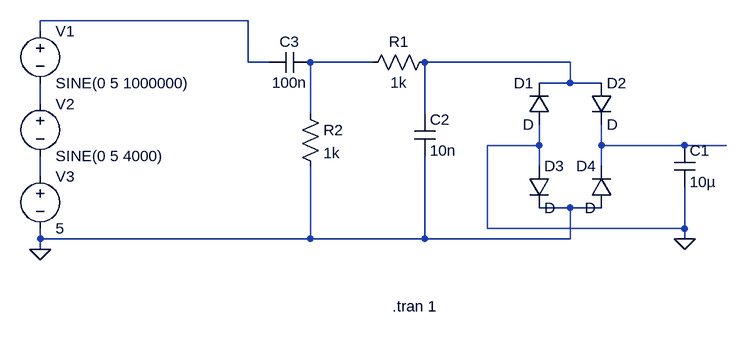
[diagram p0: schematic demodulator_spice_model.asc]
demodulator_spice_model.asc, the LTspice schematic file:
Version 4
SHEET 1 880 680
WIRE -416 -128 -736 -128
WIRE -736 -112 -736 -128
WIRE -416 -64 -416 -128
WIRE -384 -64 -416 -64
WIRE -224 -64 -320 -64
WIRE 80 -64 -144 -64
WIRE 80 -32 80 -64
WIRE 80 -32 32 -32
WIRE 128 -32 80 -32
WIRE -736 0 -736 -32
WIRE -320 16 -320 -64
WIRE -144 16 -144 -64
WIRE 32 64 32 32
WIRE 32 64 -48 64
WIRE 128 64 128 32
WIRE 256 64 128 64
WIRE 320 64 256 64
WIRE 32 96 32 64
WIRE 128 96 128 64
WIRE -736 112 -736 80
WIRE 80 160 32 160
WIRE 128 160 80 160
WIRE -48 192 -48 64
WIRE 256 192 256 128
WIRE 256 192 -48 192
WIRE -736 208 -736 192
WIRE -320 208 -320 96
WIRE -320 208 -736 208
WIRE -144 208 -144 80
WIRE -144 208 -320 208
WIRE 80 208 80 160
WIRE 80 208 -144 208
WIRE 256 208 256 192
WIRE -736 224 -736 208
FLAG 256 208 0
FLAG -736 224 0
SYMBOL diode 48 32 R180
WINDOW 0 24 64 Left 2
WINDOW 3 24 0 Left 2
SYMATTR InstName D1
SYMBOL diode 112 -32 R0
SYMATTR InstName D2
SYMBOL diode 16 96 R0
SYMATTR InstName D3
SYMBOL diode 144 160 R180
WINDOW 0 24 64 Left 2
WINDOW 3 24 0 Left 2
SYMATTR InstName D4
SYMBOL voltage -736 -128 R0
WINDOW 123 24 124 Left 2
WINDOW 39 0 0 Left 2
SYMATTR InstName V1
SYMATTR Value SINE(0 5 1000000)
SYMBOL cap 240 64 R0
SYMATTR InstName C1
SYMATTR Value 10µ
SYMBOL voltage -736 -16 R0
WINDOW 123 24 124 Left 2
WINDOW 39 0 0 Left 2
SYMATTR InstName V2
SYMATTR Value SINE(0 5 4000)
SYMBOL voltage -736 96 R0
WINDOW 123 24 124 Left 2
WINDOW 39 0 0 Left 2
SYMATTR InstName V3
SYMATTR Value 5
SYMBOL res -240 -48 R270
WINDOW 0 32 56 VTop 2
WINDOW 3 0 56 VBottom 2
SYMATTR InstName R1
SYMATTR Value 1k
SYMBOL res -336 0 R0
SYMATTR InstName R2
SYMATTR Value 1k
SYMBOL cap -160 16 R0
SYMATTR InstName C2
SYMATTR Value 10n
SYMBOL cap -320 -80 R90
WINDOW 0 0 32 VBottom 2
WINDOW 3 32 32 VTop 2
SYMATTR InstName C3
SYMATTR Value 100n
TEXT -194 312 Left 2 !.tran 1

The netlist it stands for:
* demodulator_spice_model.asc
D1 0 N003 D
D2 N003 N005 D
D3 0 0 D
D4 0 N005 D
V1 N001 N004 SINE(0 5 1000000)
C1 N005 0 10µ
V2 N004 N006 SINE(0 5 4000)
V3 N006 0 5
R1 N002 N003 1k
R2 N002 0 1k
C2 N003 0 10n
C3 N002 N001 100n
.model D D
.lib standard.dio
.tran 1
.backanno
.end